# EAGLE design PiezoPreamp_VR (EAGLE 9.6.2)
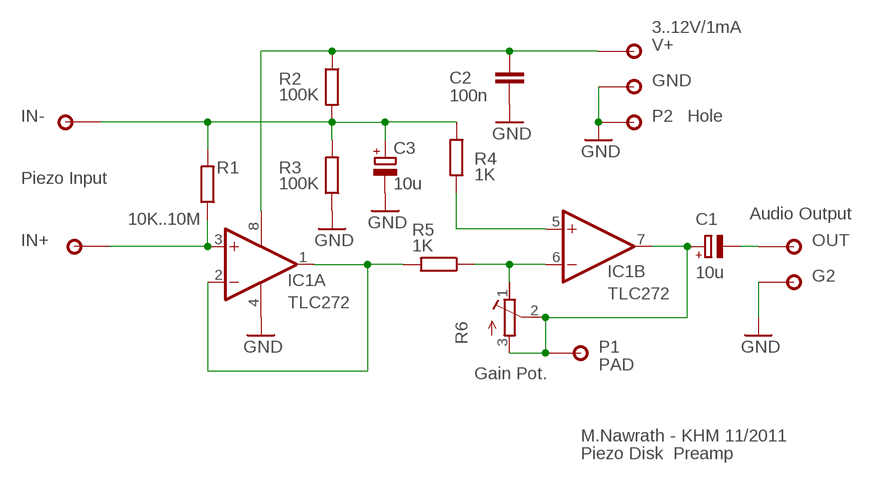
[diagram p0: schematic, sheet 1]

## Parts
C1  10u  CPOL-EUE2.5-5  [E2,5-5]
C2  100n  C-EU025-025X050  [C025-025X050]
C3  10u  CPOL-EUE2.5-5  [E2,5-5]
G2  PAD1,46MM  [PAD146]
GND  PAD1,46MM  [PAD146]
IC1  TLC272  TLC272P  [DIL08]
IN+  PAD1,46MM  [PAD146]
IN-  PAD1,46MM  [PAD146]
OUT  PAD1,46MM  [PAD146]
P1  PAD  PADL2  [PAD127L1]
P2  Hole  PAD1,46MM  [PAD146]
R1  10K..10M  R-EU_0207/10  [0207/10]
R2  100K  R-EU_0207/10  [0207/10]
R3  100K  R-EU_0207/10  [0207/10]
R4  1K  R-EU_0207/10  [0207/10]
R5  1K  R-EU_0207/10  [0207/10]
R6  R-TRIMM3006P  [RTRIM3006P]
V+  PAD1,46MM  [PAD146]

## Nets
GND: C2.1 C3.- G2.1 GND.1 IC1.4(P:V-) P2.1 R3.1
N$2: IC1.6(B:-IN) R5.1 R6.1(E)
N$3: C1.- OUT.1
N$5: IC1.5(B:+IN) R4.1
N$6: C1.+ IC1.7(B:OUT) P1.P$2 R6.2(S) R6.3(A)
N$14: IC1.1(A:OUT) IC1.2(A:-IN) R5.2
N$15: IC1.3(A:+IN) IN+.1 R1.1
N$20: C3.+ IN-.1 R1.2 R2.2 R3.2 R4.2
V9V: C2.2 IC1.8(P:V+) R2.1 V+.1

## Notes on the sheet
- 3..12V/1mA
- Piezo Input
- Audio Output
- Gain Pot.
- M.Nawrath - KHM 11/2011
- Piezo Disk  Preamp

## Library data of the parts
C1 C3 = rcl:CPOL-EU: POLARIZED CAPACITOR, European symbol
C2 = rcl:C-EU: CAPACITOR, European symbol
G2 GND IN+ IN- OUT P1 P2 V+ = 2martin:PAD
IC1 = linear:TLC272: OP AMP
R1-R5 = rcl:R-EU_: RESISTOR, European symbol
R6 = rcl:R-TRIMM: Trimm resistor; SPICEMODEL: X; SPICEPREFIXL: POT

## Board
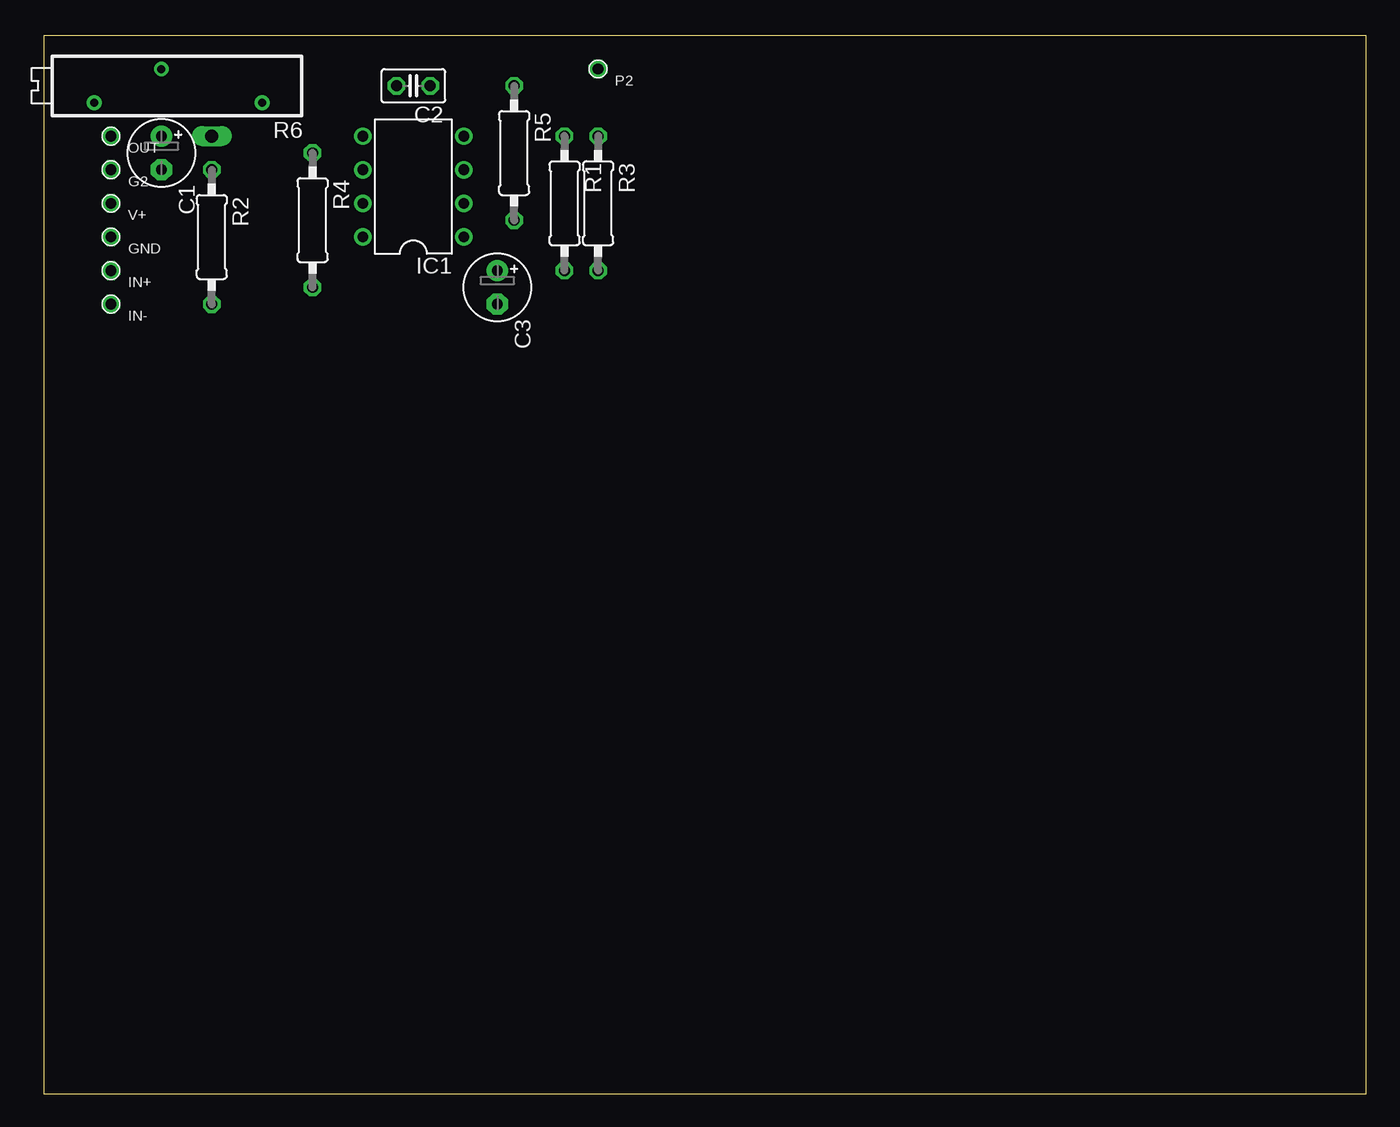
[diagram p1: board, top side]
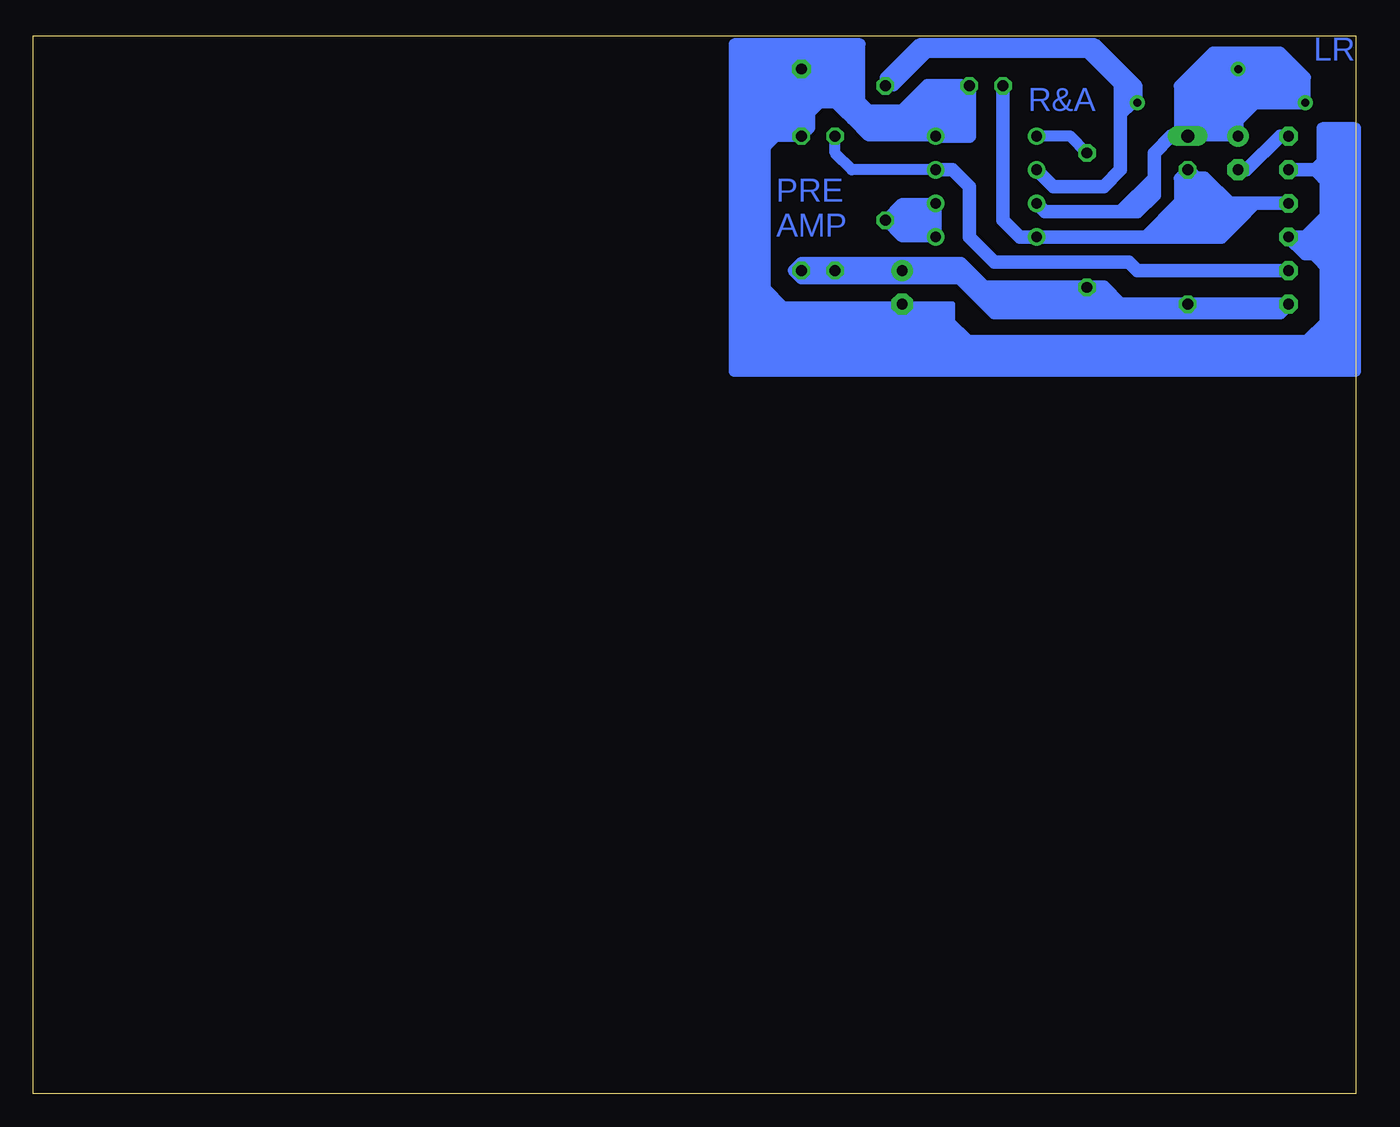
[diagram p2: board, bottom side, seen from below]

Size 100 x 80 mm. Coordinates in mm from the lower left corner, seen from the top.
Outline: 0,0 100,0 100,80 0,80 0,0
Copper layers (1*16): Top 0.035mm / dielectric 1.5mm / Bottom 0.035mm
Design rules "default": minimum track width 6mil, minimum drill 0.35mm, track to track 6mil, track to pad 6mil, pad to pad 6mil, via to via 6mil, smd to smd 6mil, copper to edge 40mil, drill to drill 6mil, minimum pad ring 10mil, minimum via ring 8mil, stop-mask expansion 4mil, vias tented up to drill 0mil, thermal gap 10mil

### Footprints (pad centres in the part's own frame; a part is rotated, then mirrored left to right if it is on the bottom)
E2,5-5 = drill 0.813 pad 1.6: + -1.27,0 | drill 0.813 pad 1.6 octagon: - 1.27,0
C025-025X050 = drill 0.813 octagon: 1 -1.27,0; 2 1.27,0
PAD146 = drill 0.813 pad 1.422 octagon: 1 0,0
DIL08 = drill 0.813 pad 1.27: 1 -3.81,-3.81; 2 -1.27,-3.81; 3 1.27,-3.81; 4 3.81,-3.81; 5 3.81,3.81; 6 1.27,3.81; 7 -1.27,3.81; 8 -3.81,3.81
PAD127L1 = drill 1 long: P$2 0,0
0207/10 = drill 0.813 octagon: 1 -5.08,0; 2 5.08,0
RTRIM3006P = drill 0.61: 1 -7.62,1.27; 2 0,-1.27; 3 5.08,1.27

### Placement (x,y rotation side)
C1  8.89,71.12 270 top
C2  27.94,76.2 180 top
C3  34.29,60.96 270 top
G2  5.08,69.85 0 top
GND  5.08,64.77 0 top
IC1  27.94,68.58 90 top
IN+  5.08,62.23 0 top
IN-  5.08,59.69 0 top
OUT  5.08,72.39 0 top
P1  12.7,72.39 180 top
P2  41.91,77.47 0 top
R1  39.37,67.31 270 top
R2  12.7,64.77 270 top
R3  41.91,67.31 270 top
R4  20.32,66.04 270 top
R5  35.56,71.12 270 top
R6  8.89,76.2 180 top
V+  5.08,67.31 0 top

### Tracks (layer width: path | path; a pad name or v marks a point on that pad's centre or on a via)
GND
  Bottom 0.152: 2.54,64.14 2.54,63.5
  Bottom 0.406: G2.1 4.45,69.85 2.54,69.85 2.54,69.22 2.54,66.04 2.54,64.77 4.45,64.77 GND.1 | 2.54,63.5 2.54,58.42 3.81,57.15 29.21,57.15 30.48,58.42 30.48,59.69 C3.- 43.18,59.69 44.45,60.96 44.45,76.2 43.18,77.47 P2.1 | P2.1 41.91,74.93 | 41.91,73.03 R3.1 | IC1.4 31.75,73.03 | 36.83,72.39 39.37,74.93 P2.1
  Bottom 0.813: 1.27,58.42 1.91,58.42 | 3.81,56.52 1.91,58.42 | 1.91,58.42 1.91,62.23 1.91,64.14 2.54,64.14 3.81,64.14 4.45,64.77 3.17,64.77 1.91,66.04 1.91,68.58 2.54,69.22 3.17,69.85 | 4.45,69.85 3.17,69.85 | 3.17,69.85 2.54,70.48 | 1.91,71.12 2.54,70.48 | 2.54,70.48 2.54,73.03 0,73.03 0,54.61 46.99,54.61 46.99,79.38 37.47,79.38 37.47,74.93 | 45.09,71.12 43.81,72.39 R3.1 41.27,73.03 41.27,74.3 41.27,74.93 39.37,74.93 | 39.37,74.93 37.47,74.93 | 37.47,74.93 37.47,73.66 38.1,73.66 | 38.1,73.66 38.73,74.3 | 39.37,74.93 38.73,74.3 | 38.73,74.3 38.1,74.3 | 38.1,74.3 36.83,73.03 36.2,73.03 | 36.2,73.03 35.56,73.03 33.02,73.03 | 33.02,73.03 32.38,73.03 | 32.38,73.03 31.75,73.03 | 31.75,73.03 31.75,74.3 | 31.75,74.3 31.75,74.93 31.75,75.56 | 31.75,75.56 31.75,76.2 29.84,76.2 C2.1 | IC1.4 36.83,72.39 38.1,73.66 | 38.1,73.66 38.1,74.3 | 38.1,74.3 37.47,74.3 36.83,73.66 36.2,73.03 | 31.75,73.03 31.11,73.03 30.8,73.34 29.84,74.3 29.84,75.56 31.75,75.56 | 31.75,75.56 31.11,74.93 31.11,74.3 | 31.11,74.3 31.11,73.66 30.48,74.3 30.48,74.93 | 31.11,74.3 32.38,73.03 | 31.75,74.3 33.02,73.03 | 41.91,73.03 41.91,74.93
  Bottom 1.016: 2.54,64.77 GND.1 | 2.54,66.04 3.81,64.77 GND.1 | GND.1 3.81,63.5 3.17,63.5 | 2.54,63.5 3.17,63.5 | 3.17,63.5 1.91,62.23 | G2.1 2.54,69.85 | 29.84,76.2 32.38,76.2 34.29,74.3 36.83,74.3 | 38.1,74.3 36.83,74.3 | 36.83,74.3 35.56,73.03 | 34.92,73.03 33.66,73.03 31.75,74.93 32.38,75.56 34.92,73.03 | 34.92,73.03 35.56,73.03 | 35.56,73.03 34.92,73.66 35.56,73.66 | C2.1 29.21,73.03 | 29.21,73.03 29.21,72.39 IC1.4 | 29.21,73.03 29.53,73.34 30.8,73.34 | 36.83,73.66 36.83,74.3 | 36.83,74.3 38.1,75.56 40.01,75.56 41.27,74.3
N$2
  Bottom 0.406: R6.1 17.78,73.66 17.78,73.03 17.78,69.85
  Bottom 0.813: R5.1 33.02,78.74 32.38,78.74 | 32.38,78.74 20.32,78.74 | 20.32,78.74 17.78,76.2 | 17.78,76.2 R6.1 16.51,76.2 19.68,79.38 33.02,79.38 35.56,76.83 R5.1 | R5.1 34.92,76.2 32.38,78.74 | 20.32,78.74 19.68,78.74 17.14,76.2 | 17.78,73.03 17.78,74.3 | 17.78,74.3 17.78,75.56 | 17.78,76.2 17.78,75.56 | 17.78,75.56 17.14,74.93 17.78,74.3
  Bottom 1.016: 17.78,76.2 17.78,69.85 19.05,68.58 22.86,68.58 IC1.6
N$3
  Bottom 1.016: OUT.1 5.71,72.39 8.26,69.85 C1.-
N$4
  Bottom 0.813: 31.11,57.78 29.84,56.52 29.21,56.52 31.11,58.42
N$5
  Bottom 0.813: R4.1 21.59,72.39 IC1.5
N$6
  Bottom 0.406: 9.53,72.39 P1.P$2 13.34,72.39
  Bottom 0.813: R6.3 3.81,76.83 5.71,78.74 10.79,78.74 13.34,76.2 13.34,72.39 12.06,72.39 | 9.53,72.39 C1.+ 8.89,73.66 R6.2 6.35,77.47 R6.3 | R6.3 4.45,75.56 4.45,76.2 | 4.45,76.2 6.35,78.11 9.53,78.11 | 9.53,73.66 9.53,72.39 | 9.53,72.39 12.06,72.39 | 12.06,72.39 12.7,73.03 12.7,76.2 10.79,78.11 9.53,78.11 | 9.53,78.11 9.53,73.66 | 9.53,73.66 10.16,73.03 12.06,73.03 12.06,76.2 10.79,77.47 10.16,77.47 10.16,73.66 11.43,73.66 11.43,76.2 10.79,76.83 10.79,74.3 | 4.45,76.2 4.45,76.83 5.71,78.11
  Bottom 1.016: 13.34,72.39 13.97,72.39 15.24,71.12 15.24,69.22 | 15.24,69.22 15.24,68.58 | 15.24,68.58 15.24,67.94 16.51,66.67 17.14,66.67 | 17.78,66.67 23.5,66.67 IC1.7 | R6.3 7.62,74.93 8.26,74.3 | 8.89,73.66 8.26,74.3 | 8.26,74.3 8.26,76.83 6.35,76.83 5.08,75.56 7.62,75.56 7.62,76.2 6.35,76.2 | 15.24,68.58 17.14,66.67 | 17.14,66.67 17.78,66.67 | 17.78,66.67 15.24,69.22
N$7
  Bottom 0.813: 42.55,59.05 43.18,59.05 45.09,60.96
N$14
  Bottom 0.406: R5.2 34.92,66.04 34.29,66.04 | 32.38,66.04 31.75,66.04
  Bottom 0.813: 31.75,66.04 IC1.1 34.29,64.77 R5.2 34.29,67.31 IC1.2 31.75,66.04 | 31.75,66.04 32.38,65.41 34.29,65.41 34.92,66.04 34.29,66.67 33.66,66.67 | 31.75,66.04 32.38,66.67 33.66,66.67 | 33.66,66.67 34.29,66.04 32.38,66.04
N$15
  Bottom 0.813: IC1.3 38.1,69.85 39.37,71.12 R1.1
  Bottom 1.016: IC1.3 30.48,69.85 29.21,68.58 29.21,64.77 27.3,62.87 17.14,62.87 16.51,62.23 IN+.1
N$20
  Bottom 0.406: R3.2 R1.2 C3.+ 29.21,62.23 | 27.94,60.96 R4.2 19.05,60.96 | IN-.1 R2.2 17.78,59.69
  Bottom 0.813: 19.68,59.05 26.67,59.05 28.57,60.96 29.21,61.59 29.84,61.59 41.91,61.59 42.55,62.23 41.91,62.87 29.84,62.87 29.21,62.23 | 27.3,60.33 27.94,60.96 29.21,62.23 | 27.3,60.33 26.67,59.69 18.41,59.69 | 17.78,59.69 18.41,59.69 | 18.41,59.69 19.05,60.33 27.3,60.33 | 29.21,62.23 R3.2
  Bottom 1.016: 28.57,60.96 19.05,60.96 17.78,59.69 IN-.1 5.71,59.05 19.68,59.05 27.3,59.05 29.84,61.59
V9V
  Bottom 0.813: 10.16,64.77 11.43,64.77 | 11.43,64.77 12.7,64.77 | 15.24,64.77 16.51,64.77 IC1.8 25.4,64.77 | 14.61,64.77 13.97,64.77 | 12.7,64.77 12.7,66.04 | 12.7,66.04 R2.1 13.34,69.22 13.34,67.31 | 13.34,66.67 13.34,66.04 13.34,65.41 13.97,64.77 | 13.97,64.77 12.7,64.77 | 11.43,64.77 12.06,65.41 12.7,66.04
  Bottom 1.016: V+.1 7.62,67.31 | 9.53,65.41 10.16,64.77 14.61,64.77 | 15.24,64.77 15.88,64.77 | C2.2 26.67,66.04 25.4,64.77 16.51,64.77 15.88,64.77 | R2.1 12.06,69.22 | 12.06,68.58 12.06,67.31 | 12.06,67.31 12.06,66.04 8.89,66.04 | 8.89,66.04 9.53,65.41 | 12.06,65.41 9.53,65.41 | 8.89,66.04 7.62,67.31 | 7.62,67.31 9.53,67.31 | 9.53,67.31 12.06,67.31 | 12.06,67.31 11.43,66.67 10.16,66.67 | 8.89,66.67 10.16,66.67 | 10.16,66.67 12.06,68.58 | 12.06,68.58 12.06,69.22 | 12.06,69.22 11.43,69.22 9.53,67.31 | 13.34,66.04 14.61,64.77 | 14.61,64.77 15.24,64.77 | 15.24,64.77 13.34,66.67 13.34,67.31 15.88,64.77
(copper drawn outside any net)
  shapes: Bottom area x7

### Text on the board
Bottom: LR | R&A | PRE / AMP